# Altium schematic sheet IA Core.SchDoc
size A3; PageSetup: Record=PageOptions|CenterHorizontal=True|CenterVertical=True|PrintScale=1.04|XCorrection=1.00|YCorrection=1.00|PrintKind=0|BorderSize=5000000|LeftOffset=0|BottomOffset=0|Orientation=2|PaperLength=1000|PaperWidth=1000|Scale=100|PaperSource=7|PrintQuality=-4|MediaType=1|DitherType=10|PaperKind=A3|PrintScaleMode=1
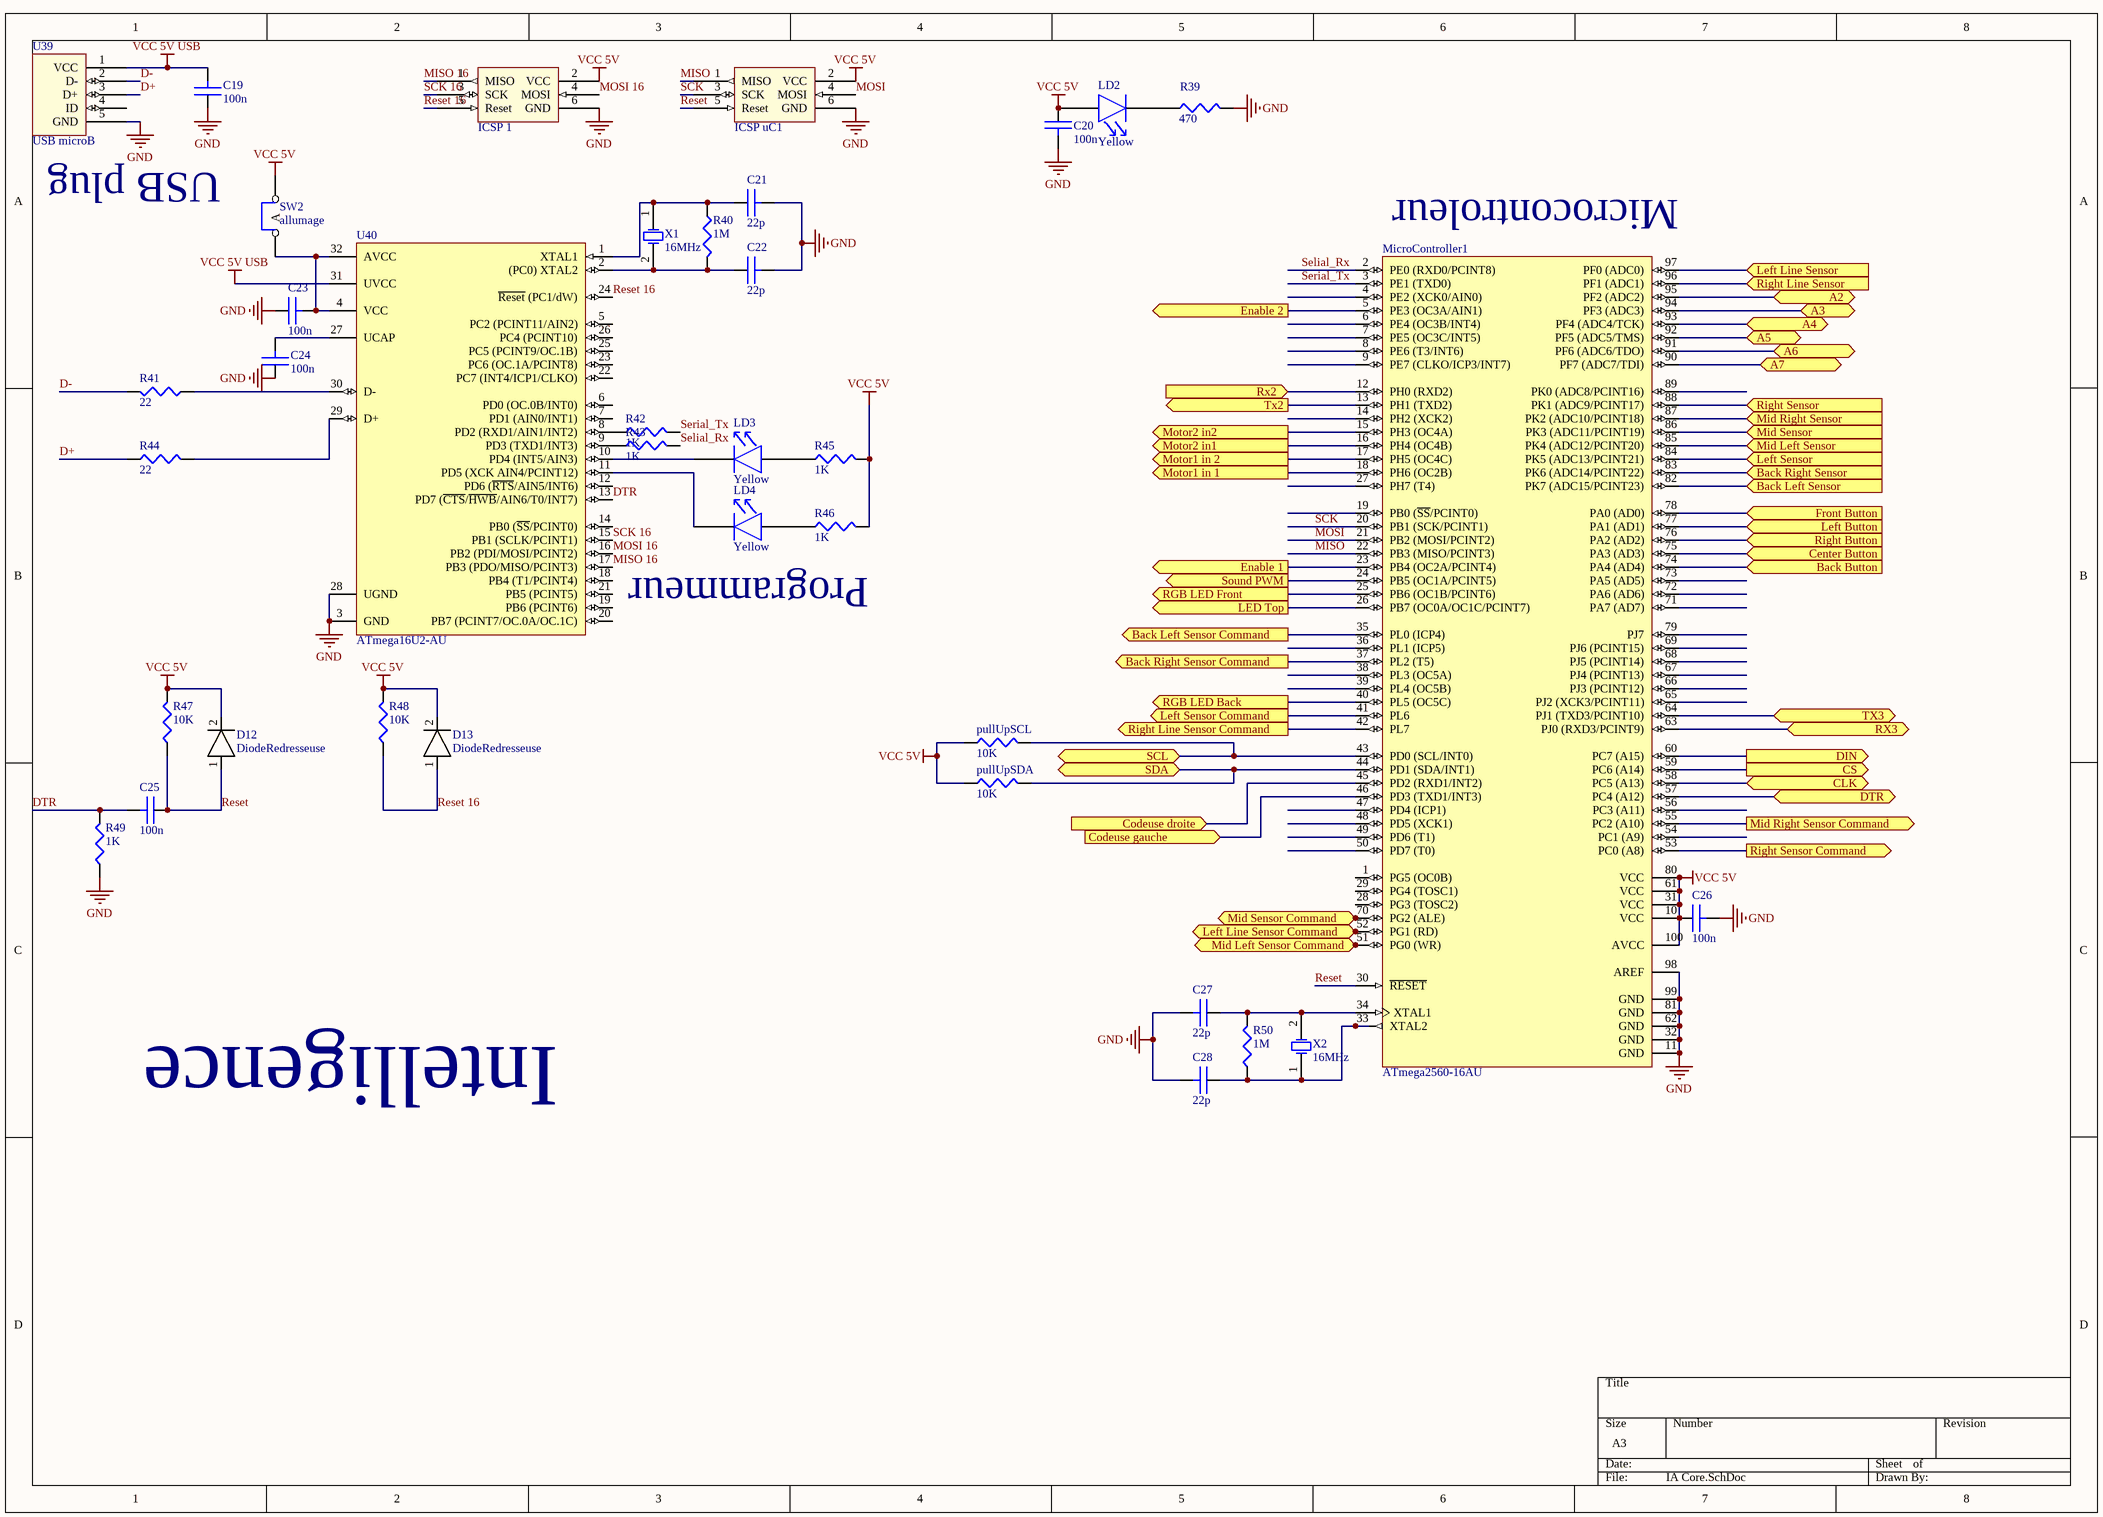
[diagram p0: IA Core.SchDoc]

## Parts
C19  value 100n  [0805]  (hidden comment: CAP)
C20  value 100n  [0805]  (hidden comment: CAP)
C21  value 22p  [0805]  (hidden comment: CAP)
C22  value 22p  [0805]  (hidden comment: CAP)
C23  value 100n  [0805]  (hidden comment: CAP)
C24  value 100n  [0805]  (hidden comment: CAP)
C25  value 100n  [0805]  (hidden comment: CAP)
C26  value 100n  [0805]  (hidden comment: CAP)
C27  value 22p  [0805]  (hidden comment: CAP)
C28  value 22p  [0805]  (hidden comment: CAP)
D12  DiodeRedresseuse  [Diode MULTICOMP SS16]
D13  DiodeRedresseuse  [Diode MULTICOMP SS16]
ICSP_1  ISCP Arduino  [Prog Arduino]  (value not drawn)
ICSP_uC1  ISCP Arduino  [Prog Arduino]  (value not drawn)
LD2  Yellow  [LED0805]
LD3  Yellow  [LED0805]
LD4  Yellow  [LED0805]
MicroController1  ATmega2560-16AU  [100A_N]
pullUpSCL  value 10K  [0805]  (hidden comment: RES)
pullUpSDA  value 10K  [0805]  (hidden comment: RES)
R39  value 470  [0805]  (hidden comment: RES)
R40  value 1M  [0805]  (hidden comment: RES)
R41  value 22  [0805]  (hidden comment: RES)
R42  value 1K  [0805]  (hidden comment: RES)
R43  value 1K  [0805]  (hidden comment: RES)
R44  value 22  [0805]  (hidden comment: RES)
R45  value 1K  [0805]  (hidden comment: RES)
R46  value 1K  [0805]  (hidden comment: RES)
R47  value 10K  [0805]  (hidden comment: RES)
R48  value 10K  [0805]  (hidden comment: RES)
R49  value 1K  [0805]  (hidden comment: RES)
R50  value 1M  [0805]  (hidden comment: RES)
SW2  allumage  [JMP2-100]
U39  USB microB  [USB micro B connector]
U40  ATmega16U2-AU  [32A_N]
X1  16MHz  [HC-49S-SMD]
X2  16MHz  [HC-49S-SMD]

## Ports
A2, A3, A4, A5, A6, A7, Back Button (in), Back Left Sensor (in), Back Left Sensor Command (out), Back Right Sensor (in), Back Right Sensor Command (out), Center Button (in), CLK (bidir), Codeuse droite (in), Codeuse gauche (in), CS (out), DIN (out), DTR (bidir), Enable 1 (out), Enable 2 (out), Front Button (in), LED Top (out), Left Button (in), Left Line Sensor (in), Left Line Sensor Command (out), Left Sensor (in), Left Sensor Command (out), Mid Left Sensor (in), Mid Left Sensor Command (out), Mid Right Sensor (in), Mid Right Sensor Command (out), Mid Sensor (in), Mid Sensor Command (out), Motor1 in 1 (out), Motor1 in 2 (out), Motor2 in1 (out), Motor2 in2 (out), RGB LED Back (out), RGB LED Front (out), Right Button (in), Right Line Sensor (in), Right Line Sensor Command (out), Right Sensor (in), Right Sensor Command (out), Rx2 (in), RX3 (bidir), SCL (bidir), SDA (bidir), Sound PWM (out), Tx2 (out), TX3 (bidir)

## Nets
GND: C19.1 C20.2 C21.2 C22.2 C23.1 C24.1 C26.2 C27.2 C28.2 ICSP_1.6(GND) ICSP_uC1.6(GND) MicroController1.11(GND) MicroController1.32(GND) MicroController1.62(GND) MicroController1.81(GND) MicroController1.98(AREF) MicroController1.99(GND) R39.2 R49.1 U39.5(GND) U39.6 U39.7 U39.8 U39.9 U39.10 U39.11 U40.3(GND) U40.28(UGND)
VCC 5V: C20.1 C26.1 D12.2 D13.2 ICSP_1.2(VCC) ICSP_uC1.2(VCC) LD2.A MicroController1.10(VCC) MicroController1.31(VCC) MicroController1.61(VCC) MicroController1.80(VCC) MicroController1.100(AVCC) pullUpSCL.1 pullUpSDA.1 R45.2 R46.2 R47.2 R48.2 SW2.2(com)
VCC 5V USB: C19.2 U39.1(VCC) U40.31(UVCC)
A2: MicroController1.95(PF2_(ADC2)) ; port A2
A3: MicroController1.94(PF3_(ADC3)) ; port A3
A4: MicroController1.93(PF4_(ADC4/TCK)) ; port A4
A5: MicroController1.92(PF5_(ADC5/TMS)) ; port A5
A6: MicroController1.91(PF6_(ADC6/TDO)) ; port A6
A7: MicroController1.90(PF7_(ADC7/TDI)) ; port A7
Back Button: MicroController1.74(PA4_(AD4)) ; port Back Button
Back Left Sensor: MicroController1.82(PK7_(ADC15/PCINT23)) ; port Back Left Sensor
Back Left Sensor Command: MicroController1.35(PL0_(ICP4)) ; port Back Left Sensor Command
Back Right Sensor: MicroController1.83(PK6_(ADC14/PCINT22)) ; port Back Right Sensor
Back Right Sensor Command: MicroController1.37(PL2_(T5)) ; port Back Right Sensor Command
Center Button: MicroController1.75(PA3_(AD3)) ; port Center Button
CLK: MicroController1.58(PC5_(A13)) ; port CLK
Codeuse droite: MicroController1.45(PD2_(RXD1/INT2)) ; port Codeuse droite
Codeuse gauche: MicroController1.46(PD3_(TXD1/INT3)) ; port Codeuse gauche
CS: MicroController1.59(PC6_(A14)) ; port CS
D+: R44.1 U39.3(D+)
D-: R41.2 U39.2(D-)
DIN: MicroController1.60(PC7_(A15)) ; port DIN
DTR: MicroController1.57(PC4_(A12)) ; port DTR
DTR: C25.2 R49.2 U40.13(PD7_(~{CTS}/~{HWB}/AIN6/T0/INT7))  [a separate net that carries the same name]
Enable 1: MicroController1.23(PB4_(OC2A/PCINT4)) ; port Enable 1
Enable 2: MicroController1.5(PE3_(OC3A/AIN1)) ; port Enable 2
Front Button: MicroController1.78(PA0_(AD0)) ; port Front Button
LED Top: MicroController1.26(PB7_(OC0A/OC1C/PCINT7)) ; port LED Top
Left Button: MicroController1.77(PA1_(AD1)) ; port Left Button
Left Line Sensor: MicroController1.97(PF0_(ADC0)) ; port Left Line Sensor
Left Line Sensor Command: MicroController1.52(PG1_(RD)) ; port Left Line Sensor Command
Left Sensor: MicroController1.84(PK5_(ADC13/PCINT21)) ; port Left Sensor
Left Sensor Command: MicroController1.41(PL6) ; port Left Sensor Command
Mid Left Sensor: MicroController1.85(PK4_(ADC12/PCINT20)) ; port Mid Left Sensor
Mid Left Sensor Command: MicroController1.51(PG0_(WR)) ; port Mid Left Sensor Command
Mid Right Sensor: MicroController1.87(PK2_(ADC10/PCINT18)) ; port Mid Right Sensor
Mid Right Sensor Command: MicroController1.55(PC2_(A10)) ; port Mid Right Sensor Command
Mid Sensor: MicroController1.86(PK3_(ADC11/PCINT19)) ; port Mid Sensor
Mid Sensor Command: MicroController1.70(PG2_(ALE)) ; port Mid Sensor Command
MISO: ICSP_uC1.1(MISO) MicroController1.22(PB3_(MISO/PCINT3))
MISO 16: ICSP_1.1(MISO) U40.17(PB3_(PDO/MISO/PCINT3))
MOSI: ICSP_uC1.4(MOSI) MicroController1.21(PB2_(MOSI/PCINT2))
MOSI 16: ICSP_1.4(MOSI) U40.16(PB2_(PDI/MOSI/PCINT2))
Motor1 in 1: MicroController1.18(PH6_(OC2B)) ; port Motor1 in 1
Motor1 in 2: MicroController1.17(PH5_(OC4C)) ; port Motor1 in 2
Motor2 in1: MicroController1.16(PH4_(OC4B)) ; port Motor2 in1
Motor2 in2: MicroController1.15(PH3_(OC4A)) ; port Motor2 in2
Reset: C25.1 D12.1 ICSP_uC1.5(Reset) MicroController1.30(~{RESET}) R47.1
Reset 16: D13.1 ICSP_1.5(Reset) R48.1 U40.24(~{Reset}_(PC1/dW))
RGB LED Back: MicroController1.40(PL5_(OC5C)) ; port RGB LED Back
RGB LED Front: MicroController1.25(PB6_(OC1B/PCINT6)) ; port RGB LED Front
Right Button: MicroController1.76(PA2_(AD2)) ; port Right Button
Right Line Sensor: MicroController1.96(PF1_(ADC1)) ; port Right Line Sensor
Right Line Sensor Command: MicroController1.42(PL7) ; port Right Line Sensor Command
Right Sensor: MicroController1.88(PK1_(ADC9/PCINT17)) ; port Right Sensor
Right Sensor Command: MicroController1.53(PC0_(A8)) ; port Right Sensor Command
Rx2: MicroController1.12(PH0_(RXD2)) ; port Rx2
RX3: MicroController1.63(PJ0_(RXD3/PCINT9)) ; port RX3
SCK: ICSP_uC1.3(SCK) MicroController1.20(PB1_(SCK/PCINT1))
SCK 16: ICSP_1.3(SCK) U40.15(PB1_(SCLK/PCINT1))
SCL: MicroController1.43(PD0_(SCL/INT0)) pullUpSCL.2 ; port SCL
SDA: MicroController1.44(PD1_(SDA/INT1)) pullUpSDA.2 ; port SDA
Selial_Rx: MicroController1.2(PE0_(RXD0/PCINT8)) R43.2
Serial_Tx: MicroController1.3(PE1_(TXD0)) R42.2
Sound PWM: MicroController1.24(PB5_(OC1A/PCINT5)) ; port Sound PWM
Tx2: MicroController1.13(PH1_(TXD2)) ; port Tx2
TX3: MicroController1.64(PJ1_(TXD3/PCINT10)) ; port TX3
NetC21_1: C21.1 R40.1 U40.1(XTAL1) X1.1(OSC1)
NetC22_1: C22.1 R40.2 U40.2((PC0)_XTAL2) X1.2(OSC2)
NetC23_2: C23.2 SW2.1(A) U40.4(VCC) U40.32(AVCC)
NetC24_2: C24.2 U40.27(UCAP)
NetC27_1: C27.1 MicroController1.34(XTAL1) R50.2 X2.2(OSC2)
NetC28_1: C28.1 MicroController1.33(XTAL2) R50.1 X2.1(OSC1)
NetLD2_K: LD2.K R39.1
NetLD3_A: LD3.A R45.1
NetLD3_K: LD3.K U40.10(PD4_(INT5/AIN3))
NetLD4_A: LD4.A R46.1
NetLD4_K: LD4.K U40.11(PD5_(XCK_AIN4/PCINT12))
NetR41_1: R41.1 U40.30(D-)
NetR42_1: R42.1 U40.8(PD2_(RXD1/AIN1/INT2))
NetR43_1: R43.1 U40.9(PD3_(TXD1/INT3))
NetR44_2: R44.2 U40.29(D+)

Not connected (* = marked no-connect by the designer): MicroController1 1(PG5_(OC0B)) 4(PE2_(XCK0/AIN0)) 6(PE4_(OC3B/INT4)) 7(PE5_(OC3C/INT5)) 8(PE6_(T3/INT6)) 9(PE7_(CLKO/ICP3/INT7)) 14(PH2_(XCK2)) 19(PB0_(~{SS}/PCINT0)) 27(PH7_(T4)) 28(PG3_(TOSC2)) 29(PG4_(TOSC1)) 36(PL1_(ICP5)) 38(PL3_(OC5A)) 39(PL4_(OC5B)) 47(PD4_(ICP1)) 48(PD5_(XCK1)) 49(PD6_(T1)) 50(PD7_(T0)) 54(PC1_(A9)) 56(PC3_(A11)) 65(PJ2_(XCK3/PCINT11)) 66(PJ3_(PCINT12)) 67(PJ4_(PCINT13)) 68(PJ5_(PCINT14)) 69(PJ6_(PCINT15)) 71(PA7_(AD7)) 72(PA6_(AD6)) 73(PA5_(AD5)) 79(PJ7) 89(PK0_(ADC8/PCINT16)); U39 4(ID); U40 5(PC2_(PCINT11/AIN2)) 6(PD0_(OC.0B/INT0)) 7(PD1_(AIN0/INT1)) 12(PD6_(~{RTS}/AIN5/INT6)) 14(PB0_(~{SS}/PCINT0)) 18(PB4_(T1/PCINT4)) 19(PB6_(PCINT6)) 20(PB7_(PCINT7/OC.0A/OC.1C)) 21(PB5_(PCINT5)) 22(PC7_(INT4/ICP1/CLKO)) 23(PC6_(OC.1A/PCINT8)) 25(PC5_(PCINT9/OC.1B)) 26(PC4_(PCINT10))

## Notes on the sheet
- USB plug
- (near MicroController1) Microcontroleur
- Programmeur
- Intelligence

## Library data of the parts
C19-C28 = CAP: capacité non polarisée
ICSP_1 ICSP_uC1 = ISCP Arduino: Programmation Port For Arduino
LD2-LD4 = LED: LED 5mm/3mm/CMS
MicroController1 = ATmega2560-16AU: 8-bit AVR Microcontroller, 4.5-5.5V, 256KB Flash, 4KB EEPROM, 8KB SRAM, 86 GPIO pins, 100-pin TQFP, Industrial Grade (-40°C to 85°C), Pb-Free; Published: 1-Apr-2010; DatasheetVersion: revL, Aug-2007; PackageVersion: revC, Oct-2001; PackageReference: 100A; Publisher: Altium Limited; PackageDescription: 100-Pin Thin Profile Plastic Quad Flat Pack (TQFP), 14 x 14 x 1.0 mm Body, 0.5 mm Pitch; Supplier 1: Digi-Key; Supplier Part Number 1: ATMEGA2560-16AU-ND; Supplier 2: Farnell; Supplier Part Number 2: 1288330; Supplier 3: Farnell; Supplier Part Number 3: 1661740; Supplier 4: Mouser; Supplier Part Number 4: 556-ATMEGA2560-16AU; Code_JEDEC: MS-026-AED; ComponentLink1Description: Manufacturer Link; ComponentLink1URL: http://www.atmel.com/products/avr/default.asp?; ComponentLink2Description: ATmega640/1280/1281/2560/2561 Datasheet; ComponentLink2URL: http://www.atmel.com/dyn/resources/prod_documents/doc2549.pdf; ComponentLink3Description: ATmega640/1280/1281/2560/2561 Summary; ComponentLink3URL: http://www.atmel.com/dyn/resources/prod_documents/2549S.pdf; ComponentLink4Description: Atmel.com Home; ComponentLink4URL: http://www.atmel.com
pullUpSCL pullUpSDA R39-R50 = RES: resistance
SW2 = JUMPER2: cavalier 1 position
U39 = USB microB: Usb female connector SMD micro B
U40 = ATmega16U2-AU: 8-bit AVR Microcontroller, 2.7-5.5V, 16KB Flash, 512 Bytes EEPROM, 512 Bytes SRAM, 32-pin TQFP, Industrial Grade (-40°C to 85°C); Published: 1-Apr-2010; DatasheetVersion: revC, Dec-2009; PackageVersion: revB, Oct-2001; PackageReference: 32A; Publisher: Altium Limited; PackageDescription: 32-Lead, 7x7x1.0 mm Body, 0.8mm Lead Pitch, Thin Profile Plastic Quad Flat Package (TQFP); Supplier 1: Digi-Key; Supplier Part Number 1: ATMEGA16U2-AU-ND; Supplier 2: Mouser; Supplier Part Number 2: 556-ATMEGA16U2-AU; Code_JEDEC: MS-026-ABA; ComponentLink1Description: Manufacturer Link; ComponentLink1URL: http://www.atmel.com/products/avr/default.asp?; ComponentLink2Description: ATmega8U2/16U2/32U2 Datasheet; ComponentLink2URL: http://www.atmel.com/dyn/resources/prod_documents/doc7799.pdf; ComponentLink3Description: ATmega8U2/16U2/32U2 Summary; ComponentLink3URL: http://www.atmel.com/dyn/resources/prod_documents/7799S.pdf; ComponentLink4Description: Atmel.com Home; ComponentLink4URL: http://www.atmel.com
X1 X2 = XTAL: Quartz; Manufacturer: Generic Components; Class I: Oscillator; Class II: Crystal Oscillator; Published: 8-Jun-2000; Revision: July-2002: Re-released for DXP Platform.; Publisher: Altium Limited